# Altium schematic sheet MEGAphone Overview.SchDoc: Mega Phone
size A2; DrawnBy: D Kleiss; Organization: Flinders University; Address1: College of Science & Engineering; Address2: Engineering Services Room 3.22; Address3: 1284 South Rd; Address4: SA 5042; DocumentNumber: A4284; Revision: 1; SheetNumber: 1; SheetTotal: 1; ProjectName: Mega Phone
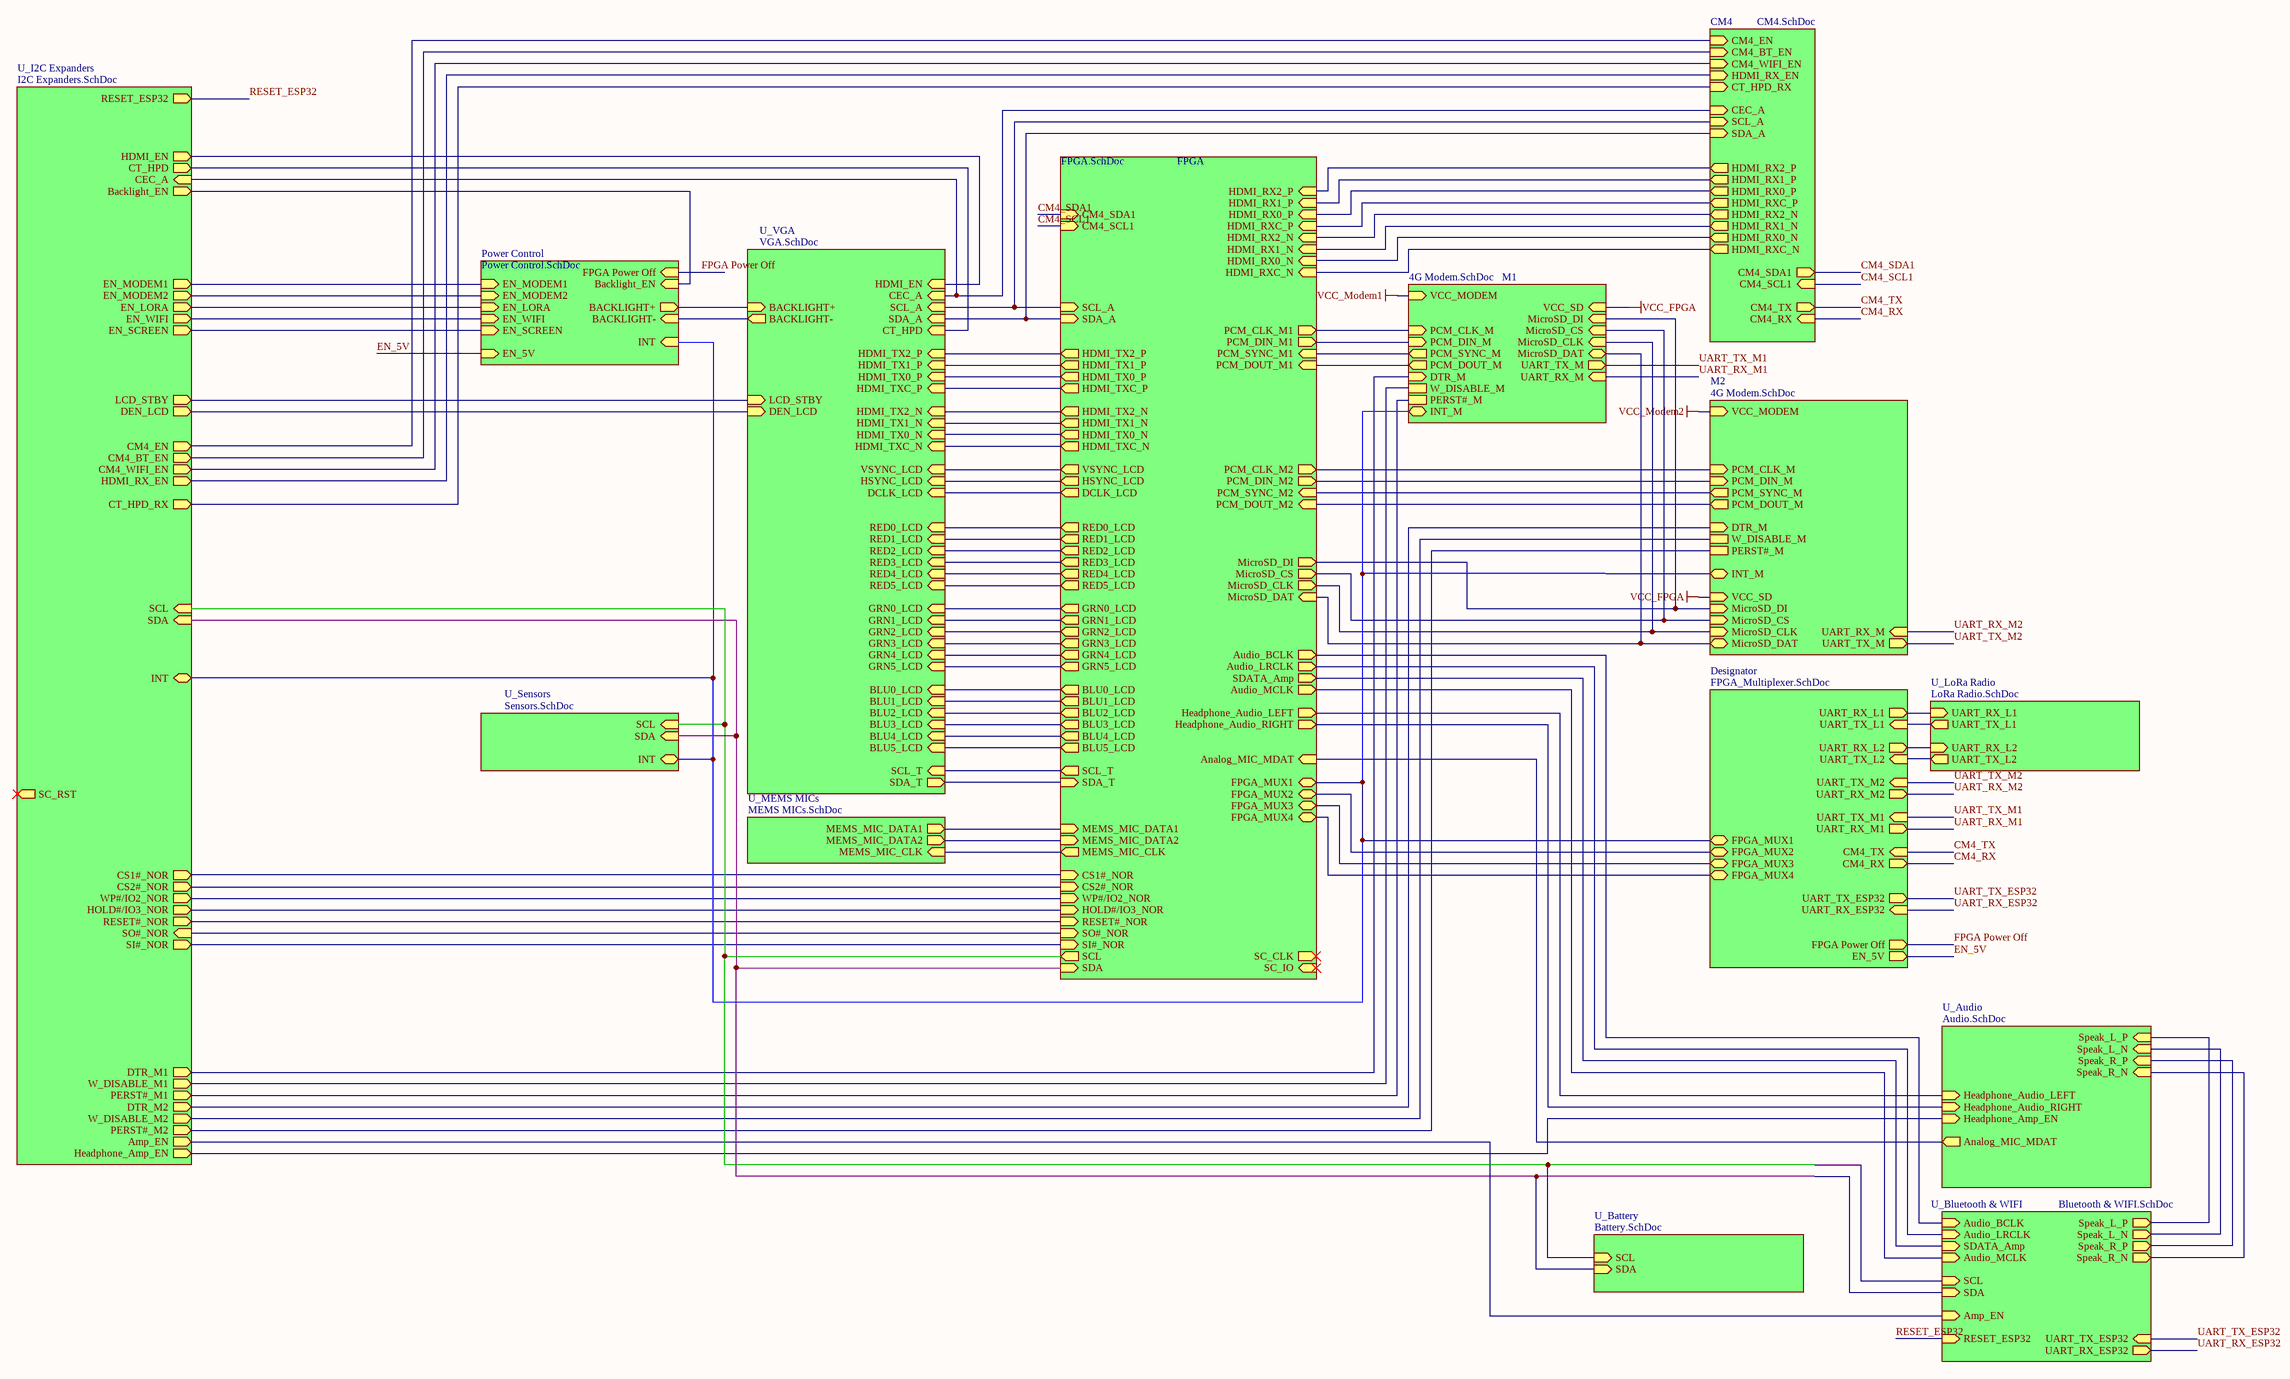
[diagram p0: MEGAphone Overview.SchDoc]

## Sub-sheets
CM4 = CM4.SchDoc: HDMI_RXC_N (out), HDMI_RX0_N (out), HDMI_RX1_N (out), HDMI_RX2_N (out), HDMI_RX0_P (out), HDMI_RX2_P (out), HDMI_RX1_P (out), HDMI_RXC_P (out), CM4_RX (in), CM4_TX (out), SDA_A (in), SCL_A (in), CEC_A (in), CM4_EN (in), CM4_BT_EN (in), CM4_WIFI_EN (in), HDMI_RX_EN (in), CT_HPD_RX (in), CM4_SDA1 (out), CM4_SCL1 (in)
Designator = FPGA_Multiplexer.SchDoc: FPGA_MUX1 (bidir), FPGA_MUX2 (bidir), FPGA_MUX3 (bidir), FPGA_MUX4 (bidir), UART_RX_L1 (out), UART_TX_L1 (in), UART_RX_L2 (out), UART_TX_L2 (in), UART_TX_M2 (in), UART_RX_M2 (out), UART_TX_M1 (in), UART_RX_M1 (out), CM4_RX (out), CM4_TX (in), UART_TX_ESP32 (out), UART_RX_ESP32 (in), FPGA Power Off (out), EN_5V (out)
FPGA = FPGA.SchDoc: DCLK_LCD (out), HSYNC_LCD (out), BLU0_LCD (out), BLU1_LCD (out), BLU2_LCD (out), BLU3_LCD (out), BLU4_LCD (out), BLU5_LCD (out), GRN0_LCD (out), GRN1_LCD (out), GRN2_LCD (out), GRN3_LCD (out), GRN4_LCD (out), GRN5_LCD (out), Audio_MCLK (out), Analog_MIC_MDAT (in), Audio_BCLK (out), Audio_LRCLK (out), VSYNC_LCD (out), RED0_LCD (out), RED1_LCD (out), RED2_LCD (out), RED3_LCD (out), RED4_LCD (out), RED5_LCD (out), PCM_CLK_M1 (out), PCM_DOUT_M1 (in), PCM_DIN_M1 (out), PCM_SYNC_M1 (in), PCM_CLK_M2 (out), PCM_DOUT_M2 (in), PCM_DIN_M2 (out), PCM_SYNC_M2 (in), Headphone_Audio_RIGHT (out), Headphone_Audio_LEFT (out), MEMS_MIC_DATA2 (in), MEMS_MIC_DATA1 (in), MEMS_MIC_CLK (out), SDATA_Amp (out), SC_CLK (out), SC_IO (in), SDA (in), SCL (out), SDA_T (in), SCL_T (out), MicroSD_CS (out), MicroSD_DAT (in), MicroSD_CLK (out), MicroSD_DI (out), CS1#_NOR (in), HOLD#/IO3_NOR (in), RESET#_NOR (in), WP#/IO2_NOR (in), CS2#_NOR (in), HDMI_TXC_N (out), HDMI_TX0_N (out), HDMI_TX1_N (out), HDMI_TX2_N (out), HDMI_TX0_P (out), HDMI_TX2_P (out), HDMI_TX1_P (out), SDA_A (in), SCL_A (in), HDMI_TXC_P (out), HDMI_RXC_N (in), HDMI_RX0_N (in), HDMI_RX1_N (in), HDMI_RX2_N (in), HDMI_RX0_P (in), HDMI_RX2_P (in), HDMI_RX1_P (in), HDMI_RXC_P (in), SI#_NOR (in), SO#_NOR (in), FPGA_MUX1 (bidir), FPGA_MUX2 (bidir), FPGA_MUX3 (bidir), FPGA_MUX4 (bidir), CM4_SDA1 (in), CM4_SCL1 (in)
M1 = 4G Modem.SchDoc: UART_RX_M (in), UART_TX_M (out), DTR_M (in), PCM_CLK_M (in), PCM_DOUT_M (out), PCM_DIN_M (in), PCM_SYNC_M (out), W_DISABLE_M, PERST#_M, INT_M (bidir), MicroSD_CLK (in), MicroSD_DI (in), MicroSD_DAT (bidir), MicroSD_CS (in), VCC_MODEM (in), VCC_SD (in)
M2 = 4G Modem.SchDoc: UART_RX_M (in), UART_TX_M (out), DTR_M (in), PCM_CLK_M (in), PCM_DOUT_M (out), PCM_DIN_M (in), PCM_SYNC_M (out), W_DISABLE_M, PERST#_M, INT_M (bidir), MicroSD_CLK (in), MicroSD_DI (in), MicroSD_DAT (bidir), MicroSD_CS (in), VCC_MODEM (in), VCC_SD (in)
Power Control = Power Control.SchDoc: FPGA Power Off (in), INT (in), EN_MODEM1 (in), EN_MODEM2 (in), EN_LORA (in), EN_WIFI (in), EN_SCREEN (in), BACKLIGHT+ (out), BACKLIGHT- (in), Backlight_EN (in), EN_5V (in)
U_Audio = Audio.SchDoc: Analog_MIC_MDAT (out), Headphone_Amp_EN (in), Headphone_Audio_LEFT (in), Headphone_Audio_RIGHT (in), Speak_L_P (in), Speak_L_N (in), Speak_R_P (in), Speak_R_N (in)
U_Battery = Battery.SchDoc: SCL (in), SDA (in)
U_Bluetooth & WIFI = Bluetooth & WIFI.SchDoc: UART_RX_ESP32 (out), UART_TX_ESP32 (in), RESET_ESP32 (in), Speak_L_P (out), Speak_L_N (out), Speak_R_P (out), Speak_R_N (out), Audio_BCLK (in), Audio_LRCLK (in), SDATA_Amp (in), Audio_MCLK (in), SCL (in), SDA (in), Amp_EN (in)
U_I2C Expanders = I2C Expanders.SchDoc: HOLD#/IO3_NOR (out), RESET#_NOR (out), CS2#_NOR (out), CS1#_NOR (out), WP#/IO2_NOR (out), DTR_M1 (out), PERST#_M1 (out), DTR_M2 (out), PERST#_M2 (out), W_DISABLE_M2 (out), W_DISABLE_M1 (out), Headphone_Amp_EN (out), EN_MODEM1 (out), EN_MODEM2 (out), EN_LORA (out), EN_WIFI (out), EN_SCREEN (out), INT (bidir), SCL (in), SC_RST (out), SDA (in), LCD_STBY (out), CM4_EN (out), CM4_BT_EN (out), CM4_WIFI_EN (out), HDMI_RX_EN (out), HDMI_EN (out), CT_HPD (out), CEC_A (in), Backlight_EN (out), DEN_LCD (out), RESET_ESP32 (out), CT_HPD_RX (out), SI#_NOR (out), SO#_NOR (in), Amp_EN (out)
U_LoRa Radio = LoRa Radio.SchDoc: UART_RX_L1 (in), UART_TX_L1 (out), UART_RX_L2 (in), UART_TX_L2 (out)
U_MEMS MICs = MEMS MICs.SchDoc: MEMS_MIC_DATA1 (out), MEMS_MIC_DATA2 (out), MEMS_MIC_CLK (in)
U_Sensors = Sensors.SchDoc: SDA (in), SCL (in), INT (bidir)
U_VGA = VGA.SchDoc: DCLK_LCD (in), DEN_LCD (in), HSYNC_LCD (in), BLU0_LCD (in), BLU1_LCD (in), BLU2_LCD (in), BLU3_LCD (in), BLU4_LCD (in), BLU5_LCD (in), GRN0_LCD (in), GRN1_LCD (in), GRN2_LCD (in), GRN3_LCD (in), GRN4_LCD (in), GRN5_LCD (in), VSYNC_LCD (in), RED0_LCD (in), RED1_LCD (in), RED2_LCD (in), RED3_LCD (in), RED4_LCD (in), RED5_LCD (in), BACKLIGHT- (out), BACKLIGHT+ (in), SCL_T (in), SDA_T (out), LCD_STBY (in), HDMI_TXC_N (in), HDMI_TX0_N (in), HDMI_TX1_N (in), HDMI_TX2_N (in), HDMI_TXC_P (in), HDMI_TX0_P (in), HDMI_TX2_P (in), HDMI_TX1_P (in), CT_HPD (in), SDA_A (in), SCL_A (in), CEC_A (in), HDMI_EN (in)

## Nets
VCC_FPGA: sheet M1/VCC_SD, sheet M2/VCC_SD
VCC_Modem1: sheet M1/VCC_MODEM
VCC_Modem2: sheet M2/VCC_MODEM
CM4_RX: sheet CM4/CM4_RX, sheet Designator/CM4_RX
CM4_SCL1: sheet FPGA/CM4_SCL1, sheet CM4/CM4_SCL1
CM4_SDA1: sheet FPGA/CM4_SDA1, sheet CM4/CM4_SDA1
CM4_TX: sheet CM4/CM4_TX, sheet Designator/CM4_TX
EN_5V: sheet Power Control/EN_5V, sheet Designator/EN_5V
FPGA Power Off: sheet Power Control/FPGA Power Off, sheet Designator/FPGA Power Off
RESET_ESP32: sheet U_I2C Expanders/RESET_ESP32, sheet U_Bluetooth & WIFI/RESET_ESP32
UART_RX_ESP32: sheet U_Bluetooth & WIFI/UART_RX_ESP32, sheet Designator/UART_RX_ESP32
UART_RX_M1: sheet M1/UART_RX_M, sheet Designator/UART_RX_M1
UART_RX_M2: sheet M2/UART_RX_M, sheet Designator/UART_RX_M2
UART_TX_ESP32: sheet U_Bluetooth & WIFI/UART_TX_ESP32, sheet Designator/UART_TX_ESP32
UART_TX_M1: sheet M1/UART_TX_M, sheet Designator/UART_TX_M1
UART_TX_M2: sheet M2/UART_TX_M, sheet Designator/UART_TX_M2
(unnamed): sheet FPGA/DCLK_LCD, sheet U_VGA/DCLK_LCD
(unnamed): sheet FPGA/HSYNC_LCD, sheet U_VGA/HSYNC_LCD
(unnamed): sheet FPGA/BLU0_LCD, sheet U_VGA/BLU0_LCD
(unnamed): sheet FPGA/BLU1_LCD, sheet U_VGA/BLU1_LCD
(unnamed): sheet FPGA/BLU2_LCD, sheet U_VGA/BLU2_LCD
(unnamed): sheet FPGA/BLU3_LCD, sheet U_VGA/BLU3_LCD
(unnamed): sheet FPGA/BLU4_LCD, sheet U_VGA/BLU4_LCD
(unnamed): sheet FPGA/BLU5_LCD, sheet U_VGA/BLU5_LCD
(unnamed): sheet FPGA/GRN0_LCD, sheet U_VGA/GRN0_LCD
(unnamed): sheet FPGA/GRN1_LCD, sheet U_VGA/GRN1_LCD
(unnamed): sheet FPGA/GRN2_LCD, sheet U_VGA/GRN2_LCD
(unnamed): sheet FPGA/GRN3_LCD, sheet U_VGA/GRN3_LCD
(unnamed): sheet FPGA/GRN4_LCD, sheet U_VGA/GRN4_LCD
(unnamed): sheet FPGA/GRN5_LCD, sheet U_VGA/GRN5_LCD
(unnamed): sheet FPGA/Audio_MCLK, sheet U_Bluetooth & WIFI/Audio_MCLK
(unnamed): sheet FPGA/Analog_MIC_MDAT, sheet U_Audio/Analog_MIC_MDAT
(unnamed): sheet FPGA/Audio_BCLK, sheet U_Bluetooth & WIFI/Audio_BCLK
(unnamed): sheet FPGA/Audio_LRCLK, sheet U_Bluetooth & WIFI/Audio_LRCLK
(unnamed): sheet FPGA/VSYNC_LCD, sheet U_VGA/VSYNC_LCD
(unnamed): sheet FPGA/RED0_LCD, sheet U_VGA/RED0_LCD
(unnamed): sheet FPGA/RED1_LCD, sheet U_VGA/RED1_LCD
(unnamed): sheet FPGA/RED2_LCD, sheet U_VGA/RED2_LCD
(unnamed): sheet FPGA/RED3_LCD, sheet U_VGA/RED3_LCD
(unnamed): sheet FPGA/RED4_LCD, sheet U_VGA/RED4_LCD
(unnamed): sheet FPGA/RED5_LCD, sheet U_VGA/RED5_LCD
(unnamed): sheet FPGA/PCM_CLK_M1, sheet M1/PCM_CLK_M
(unnamed): sheet FPGA/PCM_DOUT_M1, sheet M1/PCM_DOUT_M
(unnamed): sheet FPGA/PCM_DIN_M1, sheet M1/PCM_DIN_M
(unnamed): sheet FPGA/PCM_SYNC_M1, sheet M1/PCM_SYNC_M
(unnamed): sheet FPGA/PCM_CLK_M2, sheet M2/PCM_CLK_M
(unnamed): sheet FPGA/PCM_DOUT_M2, sheet M2/PCM_DOUT_M
(unnamed): sheet FPGA/PCM_DIN_M2, sheet M2/PCM_DIN_M
(unnamed): sheet FPGA/PCM_SYNC_M2, sheet M2/PCM_SYNC_M
(unnamed): sheet FPGA/Headphone_Audio_RIGHT, sheet U_Audio/Headphone_Audio_RIGHT
(unnamed): sheet FPGA/Headphone_Audio_LEFT, sheet U_Audio/Headphone_Audio_LEFT
(unnamed): sheet FPGA/MEMS_MIC_DATA2, sheet U_MEMS MICs/MEMS_MIC_DATA2
(unnamed): sheet FPGA/MEMS_MIC_DATA1, sheet U_MEMS MICs/MEMS_MIC_DATA1
(unnamed): sheet FPGA/MEMS_MIC_CLK, sheet U_MEMS MICs/MEMS_MIC_CLK
(unnamed): sheet FPGA/SDATA_Amp, sheet U_Bluetooth & WIFI/SDATA_Amp
(unnamed): sheet FPGA/SDA, sheet U_Battery/SDA, sheet U_I2C Expanders/SDA, sheet U_Bluetooth & WIFI/SDA, sheet U_Sensors/SDA
(unnamed): sheet FPGA/SCL, sheet U_Battery/SCL, sheet U_I2C Expanders/SCL, sheet U_Bluetooth & WIFI/SCL, sheet U_Sensors/SCL
(unnamed): sheet FPGA/SDA_T, sheet U_VGA/SDA_T
(unnamed): sheet FPGA/SCL_T, sheet U_VGA/SCL_T
(unnamed): sheet FPGA/MicroSD_CS, sheet M1/MicroSD_CS, sheet M2/MicroSD_CS
(unnamed): sheet FPGA/MicroSD_DAT, sheet M1/MicroSD_DAT, sheet M2/MicroSD_DAT
(unnamed): sheet FPGA/MicroSD_CLK, sheet M1/MicroSD_CLK, sheet M2/MicroSD_CLK
(unnamed): sheet FPGA/MicroSD_DI, sheet M1/MicroSD_DI, sheet M2/MicroSD_DI
(unnamed): sheet FPGA/CS1#_NOR, sheet U_I2C Expanders/CS1#_NOR
(unnamed): sheet FPGA/HOLD#/IO3_NOR, sheet U_I2C Expanders/HOLD#/IO3_NOR
(unnamed): sheet FPGA/RESET#_NOR, sheet U_I2C Expanders/RESET#_NOR
(unnamed): sheet FPGA/WP#/IO2_NOR, sheet U_I2C Expanders/WP#/IO2_NOR
(unnamed): sheet FPGA/CS2#_NOR, sheet U_I2C Expanders/CS2#_NOR
(unnamed): sheet FPGA/HDMI_TXC_N, sheet U_VGA/HDMI_TXC_N
(unnamed): sheet FPGA/HDMI_TX0_N, sheet U_VGA/HDMI_TX0_N
(unnamed): sheet FPGA/HDMI_TX1_N, sheet U_VGA/HDMI_TX1_N
(unnamed): sheet FPGA/HDMI_TX2_N, sheet U_VGA/HDMI_TX2_N
(unnamed): sheet FPGA/HDMI_TX0_P, sheet U_VGA/HDMI_TX0_P
(unnamed): sheet FPGA/HDMI_TX2_P, sheet U_VGA/HDMI_TX2_P
(unnamed): sheet FPGA/HDMI_TX1_P, sheet U_VGA/HDMI_TX1_P
(unnamed): sheet FPGA/SDA_A, sheet U_VGA/SDA_A, sheet CM4/SDA_A
(unnamed): sheet FPGA/SCL_A, sheet U_VGA/SCL_A, sheet CM4/SCL_A
(unnamed): sheet FPGA/HDMI_TXC_P, sheet U_VGA/HDMI_TXC_P
(unnamed): sheet FPGA/HDMI_RXC_N, sheet CM4/HDMI_RXC_N
(unnamed): sheet FPGA/HDMI_RX0_N, sheet CM4/HDMI_RX0_N
(unnamed): sheet FPGA/HDMI_RX1_N, sheet CM4/HDMI_RX1_N
(unnamed): sheet FPGA/HDMI_RX2_N, sheet CM4/HDMI_RX2_N
(unnamed): sheet FPGA/HDMI_RX0_P, sheet CM4/HDMI_RX0_P
(unnamed): sheet FPGA/HDMI_RX2_P, sheet CM4/HDMI_RX2_P
(unnamed): sheet FPGA/HDMI_RX1_P, sheet CM4/HDMI_RX1_P
(unnamed): sheet FPGA/HDMI_RXC_P, sheet CM4/HDMI_RXC_P
(unnamed): sheet FPGA/SI#_NOR, sheet U_I2C Expanders/SI#_NOR
(unnamed): sheet FPGA/SO#_NOR, sheet U_I2C Expanders/SO#_NOR
(unnamed): sheet FPGA/FPGA_MUX1, sheet Power Control/INT, sheet U_I2C Expanders/INT, sheet M1/INT_M, sheet M2/INT_M, sheet U_Sensors/INT, sheet Designator/FPGA_MUX1
(unnamed): sheet FPGA/FPGA_MUX2, sheet Designator/FPGA_MUX2
(unnamed): sheet FPGA/FPGA_MUX3, sheet Designator/FPGA_MUX3
(unnamed): sheet FPGA/FPGA_MUX4, sheet Designator/FPGA_MUX4
(unnamed): sheet U_VGA/DEN_LCD, sheet U_I2C Expanders/DEN_LCD
(unnamed): sheet U_VGA/BACKLIGHT-, sheet Power Control/BACKLIGHT-
(unnamed): sheet U_VGA/BACKLIGHT+, sheet Power Control/BACKLIGHT+
(unnamed): sheet U_VGA/LCD_STBY, sheet U_I2C Expanders/LCD_STBY
(unnamed): sheet U_VGA/CT_HPD, sheet U_I2C Expanders/CT_HPD
(unnamed): sheet U_VGA/CEC_A, sheet U_I2C Expanders/CEC_A, sheet CM4/CEC_A
(unnamed): sheet U_VGA/HDMI_EN, sheet U_I2C Expanders/HDMI_EN
(unnamed): sheet Power Control/EN_MODEM1, sheet U_I2C Expanders/EN_MODEM1
(unnamed): sheet Power Control/EN_MODEM2, sheet U_I2C Expanders/EN_MODEM2
(unnamed): sheet Power Control/EN_LORA, sheet U_I2C Expanders/EN_LORA
(unnamed): sheet Power Control/EN_WIFI, sheet U_I2C Expanders/EN_WIFI
(unnamed): sheet Power Control/EN_SCREEN, sheet U_I2C Expanders/EN_SCREEN
(unnamed): sheet Power Control/Backlight_EN, sheet U_I2C Expanders/Backlight_EN
(unnamed): sheet U_I2C Expanders/DTR_M1, sheet M1/DTR_M
(unnamed): sheet U_I2C Expanders/PERST#_M1, sheet M1/PERST#_M
(unnamed): sheet U_I2C Expanders/DTR_M2, sheet M2/DTR_M
(unnamed): sheet U_I2C Expanders/PERST#_M2, sheet M2/PERST#_M
(unnamed): sheet U_I2C Expanders/W_DISABLE_M2, sheet M2/W_DISABLE_M
(unnamed): sheet U_I2C Expanders/W_DISABLE_M1, sheet M1/W_DISABLE_M
(unnamed): sheet U_I2C Expanders/Headphone_Amp_EN, sheet U_Audio/Headphone_Amp_EN
(unnamed): sheet U_I2C Expanders/CM4_EN, sheet CM4/CM4_EN
(unnamed): sheet U_I2C Expanders/CM4_BT_EN, sheet CM4/CM4_BT_EN
(unnamed): sheet U_I2C Expanders/CM4_WIFI_EN, sheet CM4/CM4_WIFI_EN
(unnamed): sheet U_I2C Expanders/HDMI_RX_EN, sheet CM4/HDMI_RX_EN
(unnamed): sheet U_I2C Expanders/CT_HPD_RX, sheet CM4/CT_HPD_RX
(unnamed): sheet U_I2C Expanders/Amp_EN, sheet U_Bluetooth & WIFI/Amp_EN
(unnamed): sheet U_Audio/Speak_L_P, sheet U_Bluetooth & WIFI/Speak_L_P
(unnamed): sheet U_Audio/Speak_L_N, sheet U_Bluetooth & WIFI/Speak_L_N
(unnamed): sheet U_Audio/Speak_R_P, sheet U_Bluetooth & WIFI/Speak_R_P
(unnamed): sheet U_Audio/Speak_R_N, sheet U_Bluetooth & WIFI/Speak_R_N
(unnamed): sheet U_LoRa Radio/UART_RX_L1, sheet Designator/UART_RX_L1
(unnamed): sheet U_LoRa Radio/UART_TX_L1, sheet Designator/UART_TX_L1
(unnamed): sheet U_LoRa Radio/UART_RX_L2, sheet Designator/UART_RX_L2
(unnamed): sheet U_LoRa Radio/UART_TX_L2, sheet Designator/UART_TX_L2

## Notes on the sheet
- Title
- Size:
- Date:
- File:
- A2
- Number:
- Time:
- Revision:
- Sheet
- of